# EAGLE design nttb (EAGLE 7.3.0)
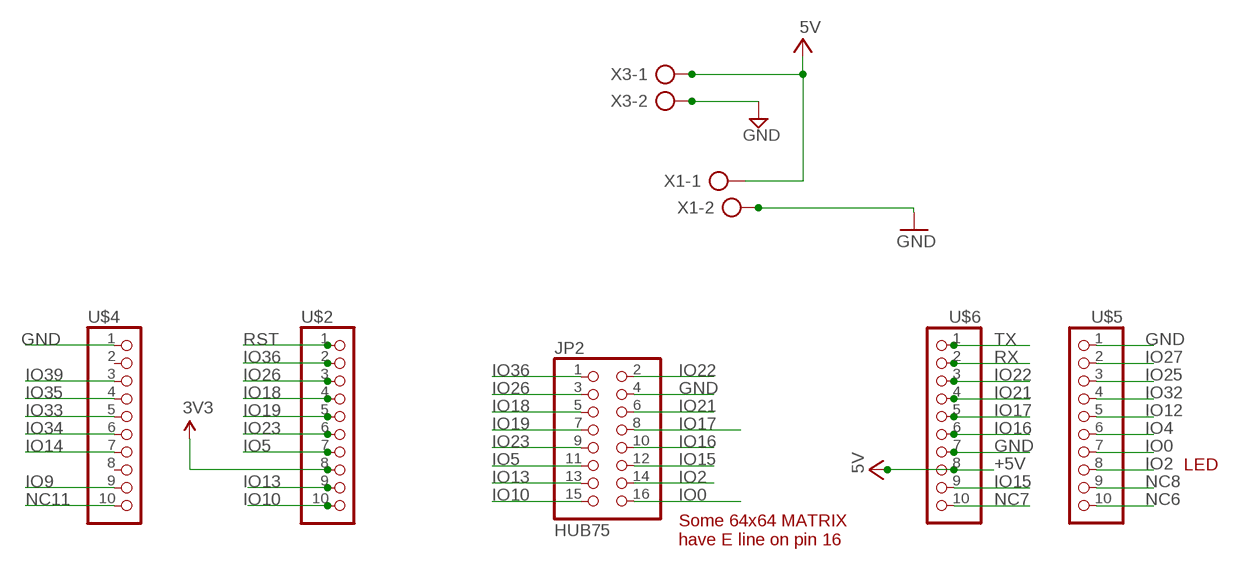
[diagram p0: schematic, sheet 1]

## Parts
JP2  HUB75  HEADER-2X8  [2X08]
U$2  PINHD-1X10  [1X10-BIG]
U$4  PINHD-1X10  [1X10-BIG]
U$5  PINHD-1X10  [1X10-BIG]
U$6  PINHD-1X10  [1X10-BIG]
X1  AK500/2  [AK500/2]
X3  AK500/2  [AK500/2]

## Nets
3V3: U$2.8
+5V: U$6.8 X1.1 X3.1 ; supply symbol labelled 5V
GND: JP2.4 U$4.1 U$5.1 U$6.7 X1.2 X3.2
IO0: JP2.16 U$5.7
IO2: JP2.14 U$5.8
IO4: U$5.6
IO5: JP2.11 U$2.7
IO9: U$4.9
IO10: JP2.15 U$2.10
IO12: U$5.5
IO13: JP2.13 U$2.9
IO14: U$4.7
IO15: JP2.12 U$6.9
IO16: JP2.10 U$6.6
IO17: JP2.8 U$6.5
IO18: JP2.5 U$2.4
IO19: JP2.7 U$2.5
IO21: JP2.6 U$6.4
IO22: JP2.2 U$6.3
IO23: JP2.9 U$2.6
IO25: U$5.3
IO26: JP2.3 U$2.3
IO27: U$5.2
IO32: U$5.4
IO33: U$4.5
IO34: U$4.6
IO35: U$4.4
IO36: JP2.1 U$2.2
IO39: U$4.3
NC6: U$5.10
NC7: U$6.10
NC8: U$5.9
NC11: U$4.10
RST: U$2.1
RX: U$6.2
TX: U$6.1
Unconnected: U$4.2 U$4.8

## Notes on the sheet
- LED
- Some 64x64 MATRIX
  have E line on pin 16

## Library data of the parts
JP2 = microbuilder:HEADER-2X8
U$2 U$4-U$6 = adafruit:PINHD-1X10: Pin header 1x10 0.1" spacing With round pins
X1 X3 = con-ptr500:AK500/2: CONNECTOR; OC_FARNELL: unknown; OC_NEWARK: unknown

## Net classes
0 default: width 0.203 mm, drill 0.356 mm, clearance 0.152 mm
1 power: width 0.203 mm, clearance 0.152 mm

## Board
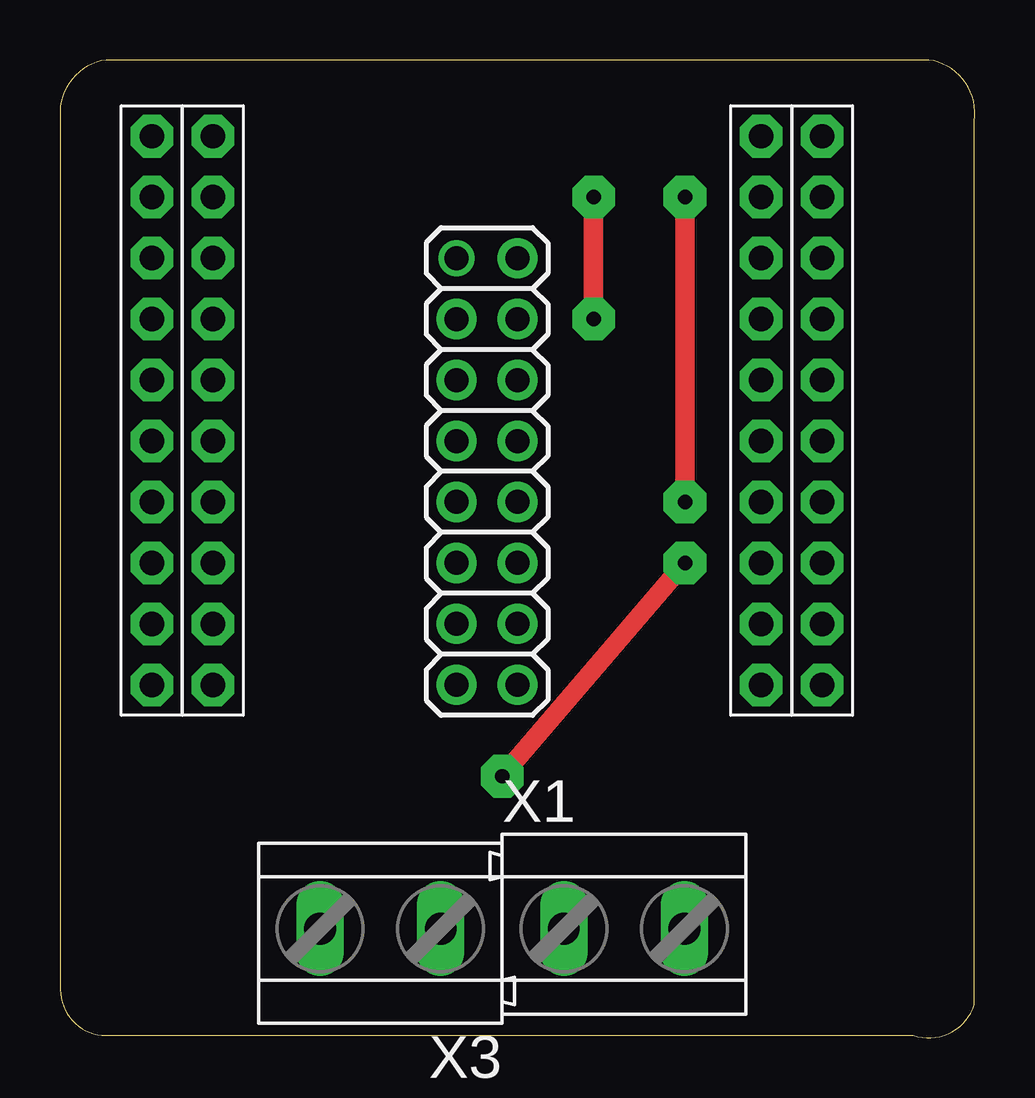
[diagram p1: board, top side]
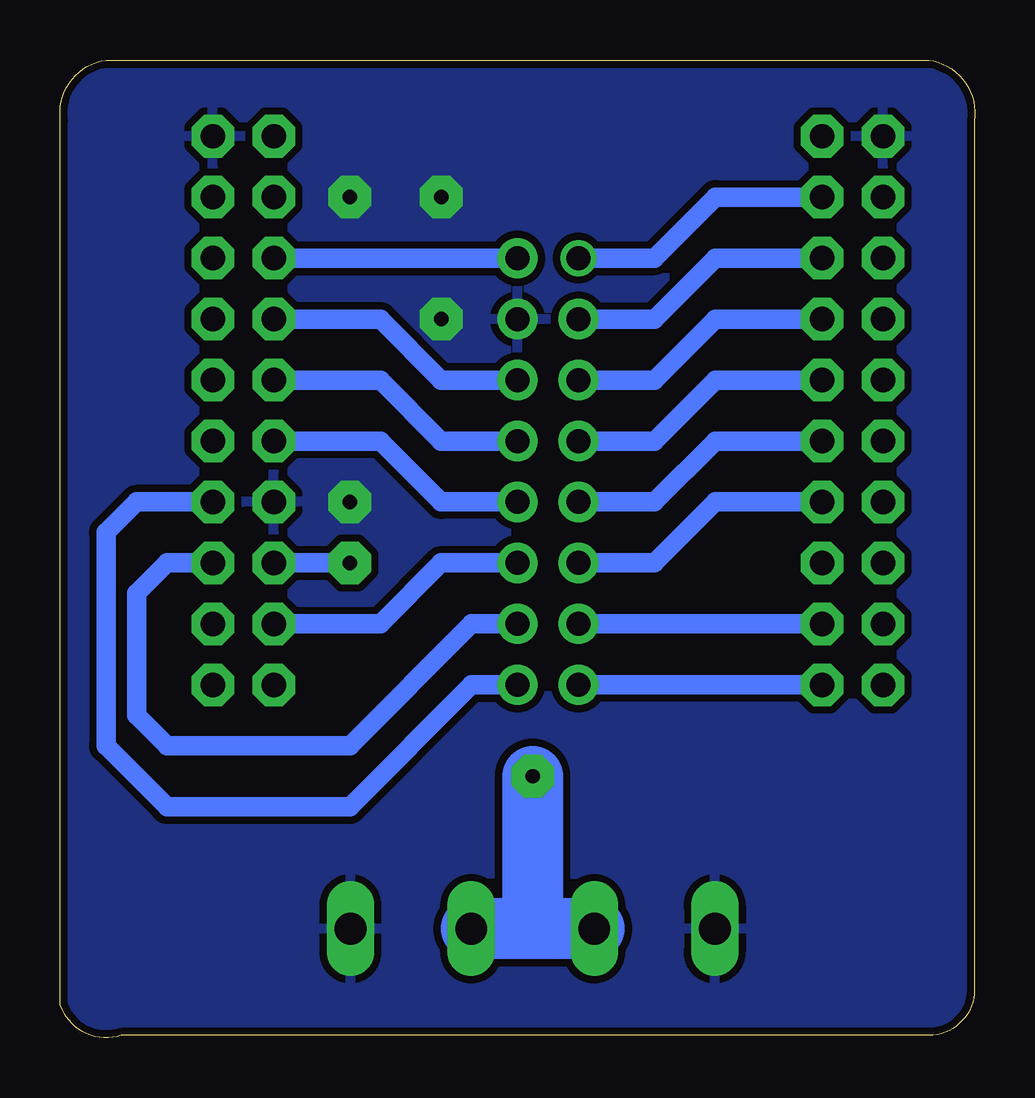
[diagram p2: board, bottom side, seen from below]

Size 38.14 x 40.74 mm. Coordinates in mm from the lower left corner, seen from the top.
Outline: 1.93,40.74 arc90 0.02,38.2 0.02,2.01 arc90 1.93,0.1 35.58,0.1 arc90 38.12,1.37 38.12,38.2 arc90 36.22,40.74 1.93,40.74
Copper layers (1*16): Top 0.035559375mm / dielectric 1.6mm / Bottom 0.035559375mm
Design rules "oshpark-2layer-tented *": minimum track width 6mil, minimum drill 10mil, track to track 6mil, track to pad 6mil, pad to pad 6mil, via to via 6mil, smd to smd 6mil, copper to edge 1mil, drill to drill 6mil, minimum pad ring 5mil, minimum via ring 5mil, stop-mask expansion 2.5mil, vias tented up to drill 30mil, thermal gap 12mil

### Footprints (pad centres in the part's own frame; a part is rotated, then mirrored left to right if it is on the bottom)
2X08 = drill 1: 1 -8.89,-1.27 | drill 1 pad 1.676: 2 -8.89,1.27; 3 -6.35,-1.27; 4 -6.35,1.27; 5 -3.81,-1.27; 6 -3.81,1.27; 7 -1.27,-1.27; 8 -1.27,1.27; 9 1.27,-1.27; 10 1.27,1.27; 11 3.81,-1.27; 12 3.81,1.27; 13 6.35,-1.27; 14 6.35,1.27; 15 8.89,-1.27; 16 8.89,1.27
1X10-BIG = drill 1.016 pad 1.778 octagon: 1 -11.43,0; 2 -8.89,0; 3 -6.35,0; 4 -3.81,0; 5 -1.27,0; 6 1.27,0; 7 3.81,0; 8 6.35,0; 9 8.89,0; 10 11.43,0
AK500/2 = drill 1.321 long: 1 -2.515,0; 2 2.515,0

### Placement (x,y rotation side)
JP2  17.8,23.6 270 top
U$2  6.37,26.14 270 top
U$4  3.83,26.14 270 top
U$5  31.77,26.14 270 top
U$6  29.23,26.14 270 top
X1  23.52,4.55 0 top
X3  13.36,4.55 180 top

### Tracks (layer width: path | path; a pad name or v marks a point on that pad's centre or on a via)
+5V  (via drill 0.6 pad 1.78)
  Top 0.813: v26.06,19.79 v18.44,10.9
  Bottom 0.813: U$6.8 v26.06,19.79
  Bottom 2.54: X3.1 18.44,4.55 | 18.44,4.55 X1.1 | v18.44,10.9 18.44,4.55
GND  (via drill 0.6 pad 1.78)
  Top 0.813: v26.06,22.33 v26.06,35.03 | v22.25,29.95 v22.25,35.03
  pour Bottom (isolate 0.305): -1.88,42.65 40.03,42.65 40.03,-1.8 -1.88,-1.8
IO0
  Bottom 0.813: U$5.7 34.95,22.33 36.22,21.06 36.22,12.17 33.68,9.63 26.06,9.63 20.98,14.71 JP2.16
IO2
  Bottom 0.813: JP2.14 20.98,17.25 26.06,12.17 33.68,12.17 34.95,13.44 34.95,18.52 33.68,19.79 U$5.8
IO5
  Bottom 0.813: JP2.11 13.36,19.79 10.82,22.33 U$2.7
IO10
  Bottom 0.813: U$2.10 JP2.15
IO13
  Bottom 0.813: U$2.9 JP2.13
IO15
  Bottom 0.813: U$6.9 24.79,17.25 22.25,19.79 JP2.12
IO16
  Bottom 0.813: JP2.10 22.25,22.33 24.79,24.87 U$6.6
IO17
  Bottom 0.813: JP2.8 22.25,24.87 24.79,27.41 U$6.5
IO18
  Bottom 0.813: JP2.5 13.36,27.41 10.82,29.95 U$2.4
IO19
  Bottom 0.813: JP2.7 13.36,24.87 10.82,27.41 U$2.5
IO21
  Bottom 0.813: JP2.6 22.25,27.41 24.79,29.95 U$6.4
IO22
  Bottom 0.813: U$6.3 JP2.2
IO23
  Bottom 0.813: JP2.9 13.36,22.33 10.82,24.87 U$2.6
IO26
  Bottom 0.813: JP2.3 13.36,29.95 10.82,32.49 U$2.3
IO36
  Bottom 0.254: 6.39,35.04 U$2.2
  Bottom 0.813: JP2.1 13.36,32.49 10.82,35.03 U$2.2